# EAGLE schematic Chargeur_batt (EAGLE 9.6.2)
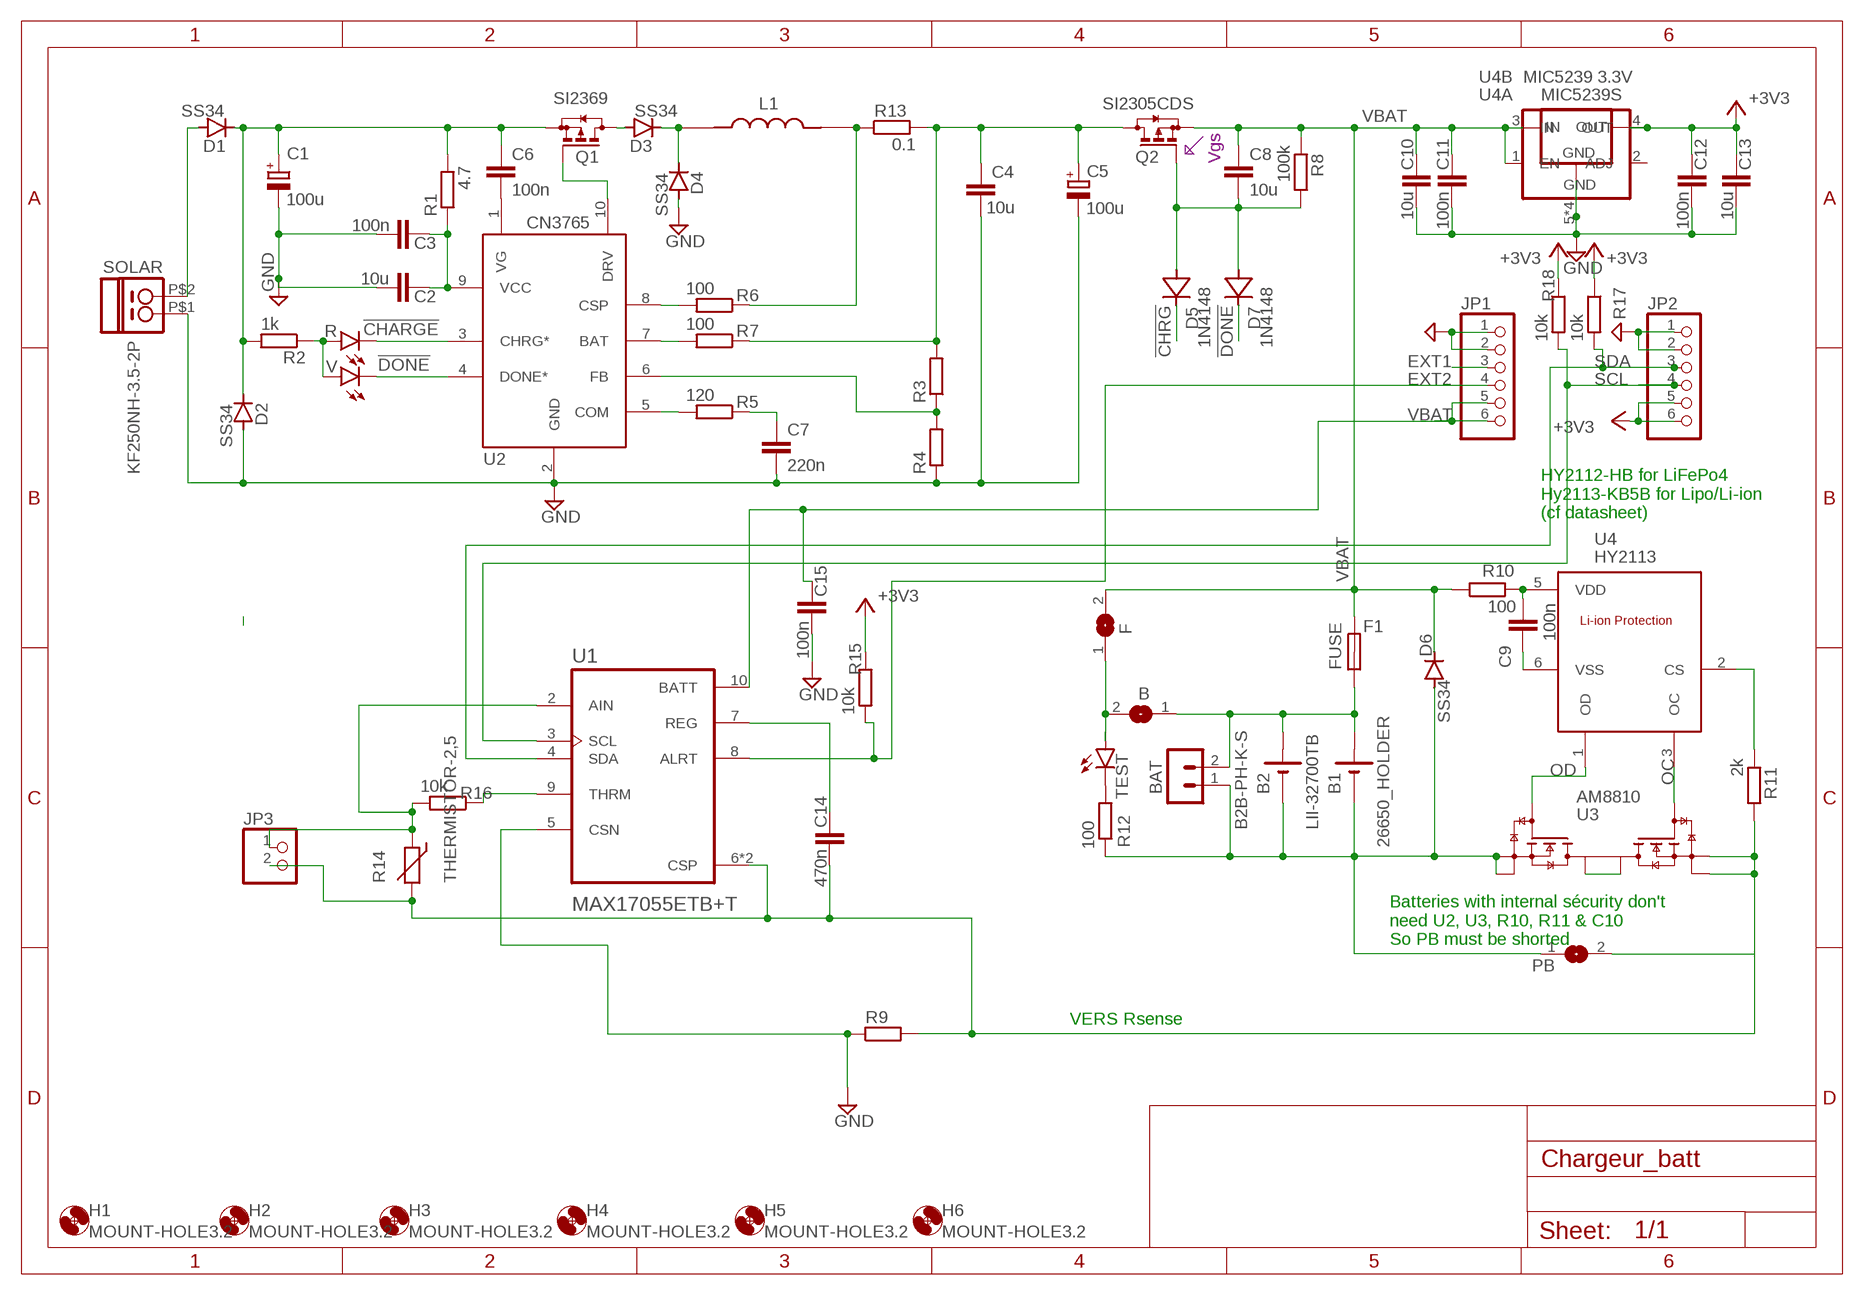
[diagram p0: schematic, sheet 1]

## Parts
B  SJ  [SJ]
B1  26650_HOLDER  [26650]
B2  LII-32700TB  [LII-32700TB]
BAT  B2B-PH-K-S  [B2B-PH-K-S]
C1  100u  CPOL-EUD  [PANASONIC_D]
C2  10u  C-EUC0805K  [C0805K]
C3  100n  C-EUC0805K  [C0805K]
C4  10u  C-EUC0805K  [C0805K]
C5  100u  CPOL-EUD  [PANASONIC_D]
C6  100n  C-EUC0805K  [C0805K]
C7  220n  C-EUC0805K  [C0805K]
C8  10u  C-EUC0805K  [C0805K]
C9  100n  C-EUC0805K  [C0805K]
C10  10u  CC1206  [C1206]
C11  100n  CC1206  [C1206]
C12  100n  CC1206  [C1206]
C13  10u  CC1206  [C1206]
C14  470n  CC1206  [C1206]
C15  100n  C-EUC0805K  [C0805K]
D1  SS34  DIODE-DO-214AC  [DO-214AC]
D2  SS34  DIODE-DO-214AC  [DO-214AC]
D3  SS34  DIODE-DO-214AC  [DO-214AC]
D4  SS34  DIODE-DO-214AC  [DO-214AC]
D5  1N4148  [VISHAY_1N4148W-E3-08_0]
D6  SS34  DIODE-DO-214AC  [DO-214AC]
D7  1N4148  [VISHAY_1N4148W-E3-08_0]
F  SJ  [SJ]
F1  FUSE  [R1206]
H1  MOUNT-HOLE3.2  [3,2]
H2  MOUNT-HOLE3.2  [3,2]
H3  MOUNT-HOLE3.2  [3,2]
H4  MOUNT-HOLE3.2  [3,2]
H5  MOUNT-HOLE3.2  [3,2]
H6  MOUNT-HOLE3.2  [3,2]
JP1  PINHD-1X6S  [1X06S]
JP2  PINHD-1X6S  [1X06S]
JP3  PINHD-1X2  [1X02]
L1  IND15  [IND_15]
PB  SJ  [SJ]
Q1  SI2369  [SOT23]
Q2  SI2305CDS  [SOT23]
R  LEDSML0805  [SML0805]
R1  4.7  R-EU_R1206  [R1206]
R2  1k  R-EU_R1206  [R1206]
R3  R-EU_R1206  [R1206]
R4  R-EU_R1206  [R1206]
R5  120  R-EU_R1206  [R1206]
R6  100  R-EU_R1206  [R1206]
R7  100  R-EU_R1206  [R1206]
R8  100k  R-EU_M1206  [M1206]
R9  R-EU_R2512  [R2512]
R10  100  R-EU_R1206  [R1206]
R11  2k  R-EU_R1206  [R1206]
R12  100  R-EU_R1206  [R1206]
R13  0.1  R-EU_R2512  [R2512]
R14  THERMISTOR-2,5  [RS-2,5]
R15  10k  R-EU_R1206  [R1206]
R16  10k  R-EU_R1206  [R1206]
R17  10k  R-EU_R1206  [R1206]
R18  10k  R-EU_R1206  [R1206]
SOLAR  KF250NH-3.5-2P  [KF250NH-3.5-2P]
TEST  LEDSML0805  [SML0805]
U1  MAX17055ETB+T  [SON40P200X250X80-11N]
U2  CN3765  [SSOP]
U3  AM8810  [TSSOP8]
U4  HY2113  [SOT23-6]
U4A  MIC5239S  [SOT223]
U4B  MIC5239 3.3V  MIC5239-ADJMM  [MSOP08]
V  LEDSML0805  [SML0805]

## Nets
!CHARGE: R.C U2.3(CHRG*)
!CHRG: D5.1(C)
!DONE: D7.1(C) U2.4(DONE*) V.C
+3V3: C12.1 C13.1 JP2.5 JP2.6 R15.1 R17.1 R18.1 U4A.3(OUT) U4B.4(OUT)
B: B1.+ B2.+ B.1 BAT.2 F1.1
BAT-1: B1.- B2.- BAT.1 D6.A PB.1 R12.2 U3.2(S1) U3.3(S1A)
EXT1: JP1.3
EXT2: JP1.4 R15.2 U1.8(ALRT)
GND: C1.- C2.2 C3.2 C4.2 C5.- C7.2 C10.2 C11.2 C12.2 C13.2 C15.2 D2.A D4.A JP1.1 JP1.2 JP2.1 JP2.2 R4.1 R9.1 SOLAR.P$1 U1.5(CSN) U2.2(GND) U4A.2(GND) U4A.4(GND) U4B.5(GND) U4B.6(GND) U4B.7(GND) U4B.8(GND)
N$1: C14.2 JP3.2 PB.2 R9.2 R11.2 R14.2 U1.6(CSP) U1.11(CSP) U3.6(S2) U3.7(S2A)
N$2: C4.1 C5.+ Q2.3(D) R3.2 R7.1 R13.2
N$4: C6.2 U2.1(VG)
N$5: D3.A Q1.3(D)
N$6: C2.1 C3.1 R1.1 U2.9(VCC)
N$7: C8.2 D5.2(A) D7.2(A) Q2.1(G) R8.2
N$8: C7.1 R5.1
N$9: C9.1 R10.2 U4.5(VDD)
N$10: U3.1(D1) U3.8(D2)
N$11: R3.1 R4.2 U2.6(FB)
N$12: Q1.1(G) U2.10(DRV)
N$13: D3.C D4.C L1.1
N$14: L1.2 R6.1 R13.1
N$15: D1.A SOLAR.P$2
N$16: R12.1 TEST.C
N$17: C1.+ C6.1 D1.C D2.C Q1.2(S) R1.2 R2.2
N$18: R6.2 U2.8(CSP)
N$19: R7.2 U2.7(BAT)
N$20: R16.1 U1.9(THRM)
N$21: R5.2 U2.5(COM)
N$22: JP3.1 R14.1 R16.2 U1.2(AIN)
N$23: R2.1 R.A V.A
N$24: C14.1 U1.7(REG)
N$27: R11.1 U4.2(CS)
N$29: B.2 F.1 TEST.A
N$30: C9.2 U4.6(VSS)
OC: U3.5(G2) U4.3(OC)
OD: U3.4(G1) U4.1(OD)
SCL: JP2.4 R18.2 U1.3(SCL)
SDA: JP2.3 R17.2 U1.4(SDA)
VBAT: C8.1 C10.1 C11.1 C15.1 D6.C F1.2 F.2 JP1.5 JP1.6 Q2.2(S) R8.1 R10.1 U1.10(BATT) U4A.1(IN) U4B.1(EN) U4B.3(IN)
Unconnected: U4B.2(ADJ)

## Notes on the sheet
- Vgs
- HY2112-HB for LiFePo4
  Hy2113-KB5B for Lipo/Li-ion
  (cf datasheet)
- Batteries with internal sécurity don't 
  need U2, U3, R10, R11 & C10
  So PB must be shorted
- VERS Rsense

## Library data of the parts
B F PB = jumper:SJ: SMD solder JUMPER
B1 = battery_bms:26650_HOLDER: 28650 holder
B2 = battery_bms:LII-32700: Modèle: Lii-32700A Type De batterie: Lifepo4 Capacité nominale: 7Ah, 6.5Ah Tension nominale: 3.2 V Batterie Dimension: 32x70mm Résistance interne: moins de 8 mohms Entrée Tension De Charge: 3.65 V/cellule Entrée Courant De Charge: 3A Continu Courant De Décharge: 30A Tension de coupure de décharge: 2.50 V/cellule Température: 0 ~ 45 °C
BAT = con-JST PH:B2B-PH: JST PH series header 2.00mm pitch disconnectable crimp style connectors, vertical (side entry type), 2 pins
C1 C5 = rcl:CPOL-EU: POLARIZED CAPACITOR, European symbol; SPICEPREFIX: C
C2-C4 C6-C9 C15 = rcl:C-EU: CAPACITOR, European symbol; SPICEPREFIX: C
C10-C14 = eagle-ltspice:C: CAPACITOR, European symbol; SPICEMODEL: NONE; SPICEPREFIX: C
D1-D4 D6 = diode:DIODE-: DIODE
D5 D7 = 1N4148W-E3-08:1N4148: Diode Standard 75V 150mA Surface Mount SOD-123
F1 = rcl-perso:FUSE
H1-H6 = holes:MOUNT-HOLE: MOUNTING HOLE with drill center marker
JP1 JP2 = pinheadCP:PINHD-1X6: PIN HEADER
JP3 = pinhead:PINHD-1X2: PIN HEADER
L1 = SnapEDA-Library+ind:IND: Line Inductors for RECOM Power Supply
Q1 = transistor-small-signal-perso:SI2369: P-CHANNEL MOS FET
Q2 = transistor-small-signal-perso:SI2305CDS: P-CHANNEL MOS FET
R TEST V = led:LED: LED OSRAM: - CHIPLED LG R971, LG N971, LY N971, LG Q971, LY Q971, LO R971, LY R971 LH N974, LH R974 LS Q976, LO Q976, LY Q976 LO Q996 - Hyper CHIPLED LW Q18S LB Q993, LB Q99A, LB R99A - SideLED LS A670, LO A670, LY A670, LG A670, LP A670 LB A673, LV A673, LT A673, LW A673 LH A674 LY A675 LS A676, LA A676, LO A676, LY A676, LW A676 LS A679, LY A679, LG A679 - Hyper Micro SIDELED® LS Y876, LA Y876, LO Y876, LY Y876 LT Y87S - SmartLED LW L88C, LW L88S LB L89C, LB L89S, LG L890 LS L89K, LO L89K, LY L89K LS L896, LA L896, LO L896, LY L896 - TOPLED LS T670, LO T670, LY T670, LG T670, LP T670 LSG T670, LSP T670, LSY T670, LOP T670, LYG T670 LG T671, LOG T671, LSG T671 LB T673, LV T673, LT T673, LW T673 LH T674 LS T676, LA T676, LO T676, LY T676, LB T676, LH T676, LSB T676, LW T676 LB T67C, LV T67C, LT T67C, LS T67K, LO T67K, LY T67K, LW E67C LS E67B, LA E67B, LO E67B, LY E67B, LB E67C, LV E67C, LT E67C LW T67C LS T679, LY T679, LG T679 LS T770, LO T770, LY T770, LG T770, LP T770 LB T773, LV T773, LT T773, LW T773 LH T774 LS E675, LA E675, LY E675, LS T675 LS T776, LA T776, LO T776, LY T776, LB T776 LHGB T686 LT T68C, LB T68C - Hyper Mini TOPLED® LB M676 - Mini TOPLED Santana® LG M470 LS M47K, LO M47K, LY M47K Source: http://www.osram.convergy.de LUXEON: - LUMILED® LXK2-PW12-R00, LXK2-PW12-S00, LXK2-PW14-U00, LXK2-PW14-V00 LXK2-PM12-R00, LXK2-PM12-S00, LXK2-PM14-U00 LXK2-PE12-Q00, LXK2-PE12-R00, LXK2-PE12-S00, LXK2-PE14-T00, LXK2-PE14-U00 LXK2-PB12-K00, LXK2-PB12-L00, LXK2-PB12-M00, LXK2-PB14-N00, LXK2-PB14-P00, LXK2-PB14-Q00 LXK2-PR12-L00, LXK2-PR12-M00, LXK2-PR14-Q00, LXK2-PR14-R00 LXK2-PD12-Q00, LXK2-PD12-R00, LXK2-PD12-S00 LXK2-PH12-R00, LXK2-PH12-S00 LXK2-PL12-P00, LXK2-PL12-Q00, LXK2-PL12-R00 Source: www.luxeon.com KINGBRIGHT: KA-3528ASYC Source: www.kingbright.com
R1-R7 R9 R10 R12 R13 R15-R18 = rcl:R-EU_: RESISTOR, European symbol; SPICEPREFIX: R
R8 R11 = resistor:R-EU_: RESISTOR, European symbol
R14 = varistor:THERMISTOR: THERMISTOR
SOLAR = MyLIB:KF250NH-3.5-2P: Cixi Kefa Elec KF250NH-3.5-2P
U1 = SnapEDA-Library2025:MAX17055ETB+T; AVAILABILITY: Unavailable; DESCRIPTION: Fuel Gauge Li-Ion/Li-FePO4 10-Pin TDFN EP Cut Tape; MF: Maxim Integrated; MP: MAX17055ETB+T; PACKAGE: TDFN-EP-10 Maxim; PRICE: None
U2 = diy-modules1.8-perso:CN3765: CN3765 4A, Multi-Chemistry Battery Charger www.consonance-elec.com
U3 = battery_bms:AM8810: DUAL N-CHANNEL ENHANCEMENT MODE POWER MOSFET
U4 = battery_bms:HY2113: 1-Cell LiFePO4 Battery Packs Protection ICs
U4A = micrel:MIC5239S: LDO REGULATOR
U4B = micrel:MIC5239-ADJ: LDO REGULATOR